# EAGLE design Grove Shield (EAGLE 9.6.2)
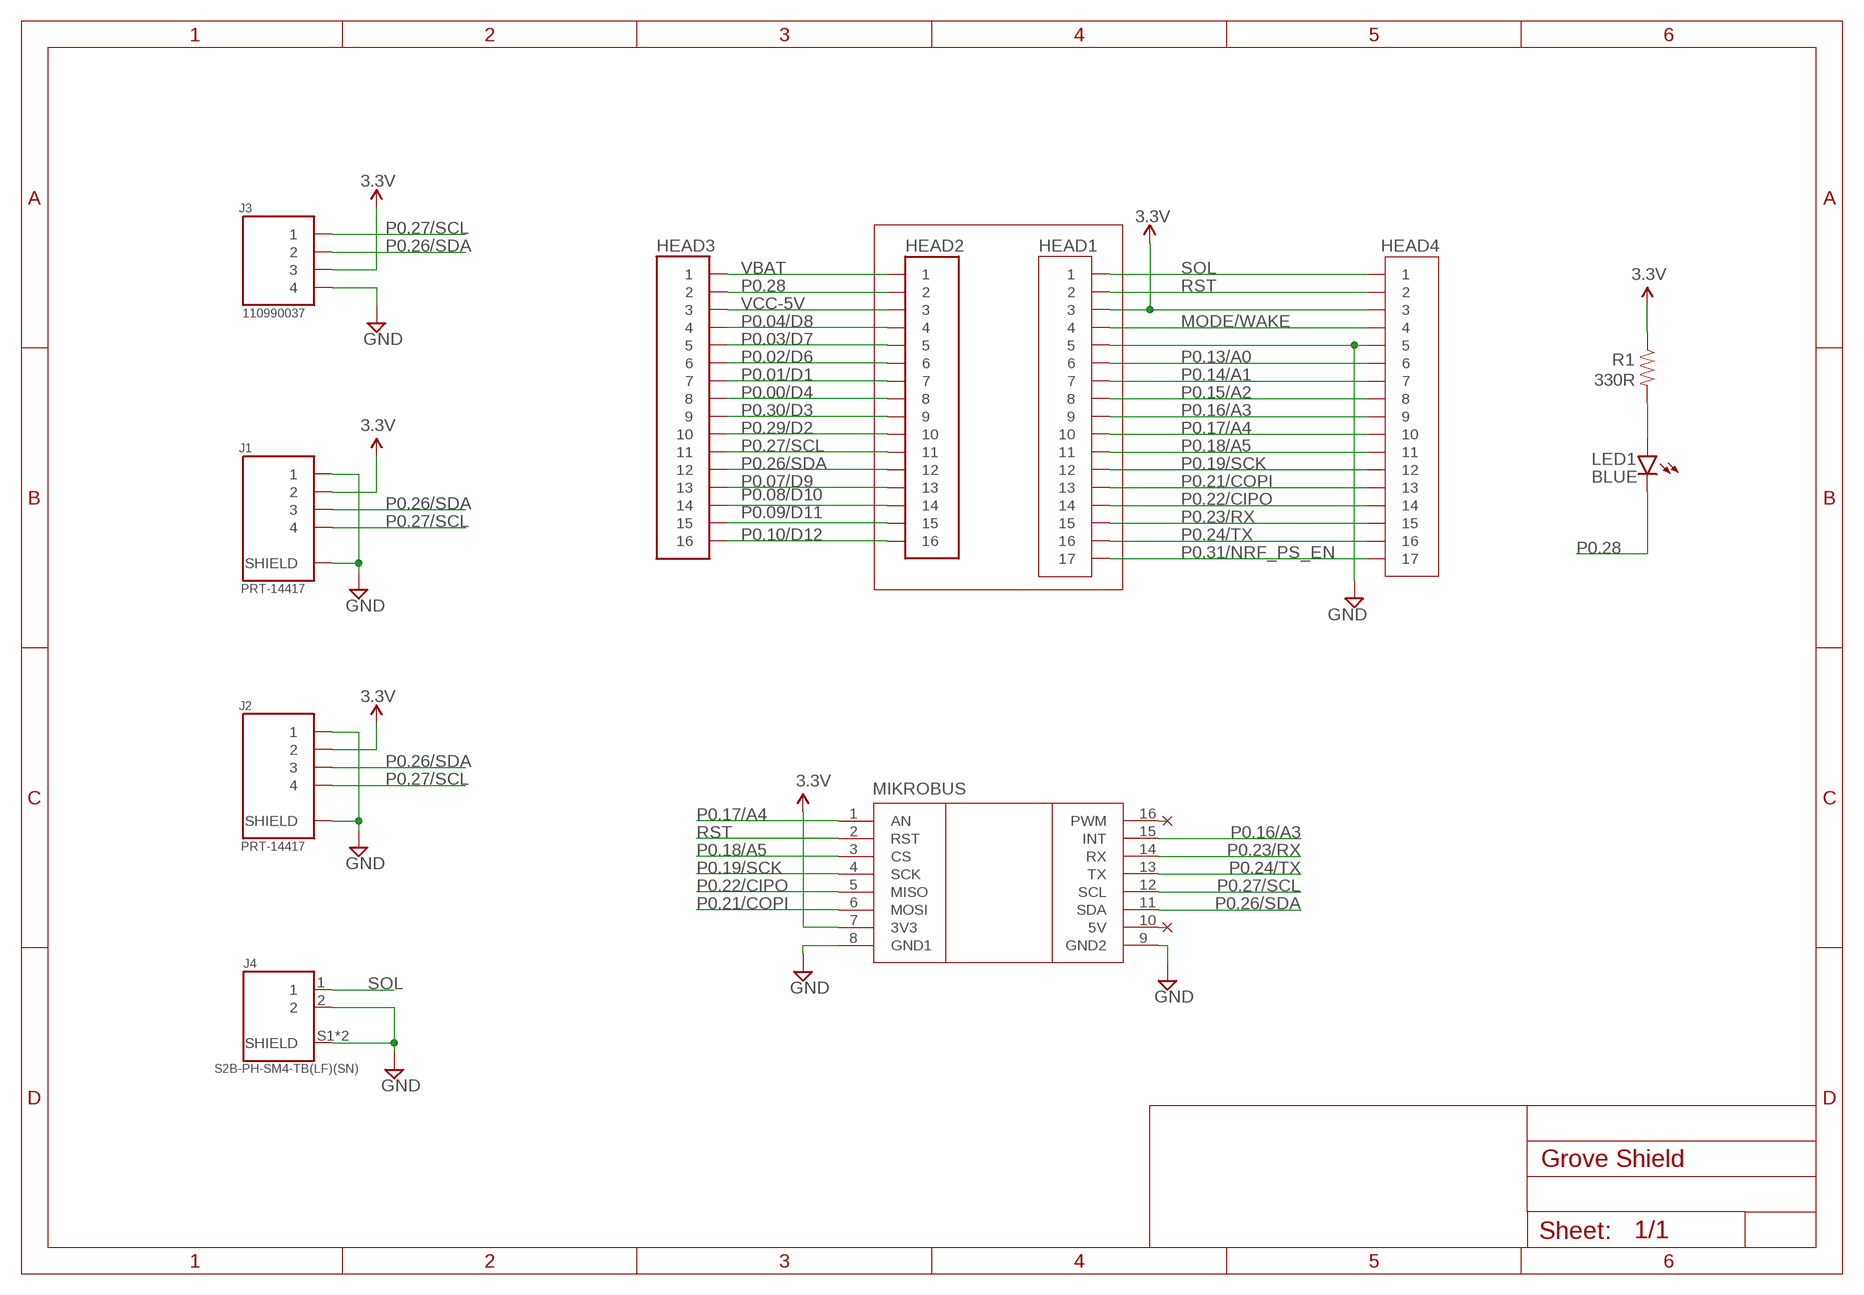
[diagram p0: schematic, sheet 1]

## Parts
HEAD1  HEADER_16P  [HEADER_16P2.54]
HEAD2  SIP-12  [SIP-12]
HEAD3  SIP-12  [SIP-12]
HEAD4  HEADER_16P  [HEADER_16P2.54]
J1  PRT-14417  SM04B-SRSS-TB(LF)(SN)  [JST_SM04B-SRSS-TB(LF)(SN)]
J2  PRT-14417  SM04B-SRSS-TB(LF)(SN)  [JST_SM04B-SRSS-TB(LF)(SN)]
J3  110990037  11099003790D  [HW4-2.0-90D]
J4  S2B-PH-SM4-TB(LF)(SN)  [JST_S2B-PH-SM4-TB(LF)(SN)]
J11  MIKROBUS  [MIKROBUS]
LED1  BLUE  LOL29K-H2L1-24-Z  [LED-0603]
R1  330R  R-0603  [R-0603]

## Nets
3.3V: HEAD1.3 HEAD4.3 J1.2 J2.2 J3.3 J11.7(3V3) R1.1
GND: HEAD1.5 HEAD4.5 J1.1 J1.S1(SHIELD) J1.S2(SHIELD) J2.1 J2.S1(SHIELD) J2.S2(SHIELD) J3.4 J4.2 J4.S1(SHIELD) J4.S2(SHIELD) J11.8(GND1) J11.9(GND2)
MODE/WAKE: HEAD1.4 HEAD4.4
N$1: J11.10(5V)
N$2: J11.16(PWM)
N$3: LED1.A R1.2
P0.00/D4: HEAD2.8 HEAD3.8
P0.01/D1: HEAD2.7 HEAD3.7
P0.02/D6: HEAD2.6 HEAD3.6
P0.03/D7: HEAD2.5 HEAD3.5
P0.04/D8: HEAD2.4 HEAD3.4
P0.07/D9: HEAD2.13 HEAD3.13
P0.08/D10: HEAD2.14 HEAD3.14
P0.09/D11: HEAD2.15 HEAD3.15
P0.10/D12: HEAD2.16 HEAD3.16
P0.13/A0: HEAD1.6 HEAD4.6
P0.14/A1: HEAD1.7 HEAD4.7
P0.15/A2: HEAD1.8 HEAD4.8
P0.16/A3: HEAD1.9 HEAD4.9 J11.15(INT)
P0.17/A4: HEAD1.10 HEAD4.10 J11.1(AN)
P0.18/A5: HEAD1.11 HEAD4.11 J11.3(CS)
P0.19/SCK: HEAD1.12 HEAD4.12 J11.4(SCK)
P0.21/COPI: HEAD1.13 HEAD4.13 J11.6(MOSI)
P0.22/CIPO: HEAD1.14 HEAD4.14 J11.5(MISO)
P0.23/RX: HEAD1.15 HEAD4.15 J11.14(RX)
P0.24/TX: HEAD1.16 HEAD4.16 J11.13(TX)
P0.26/SDA: HEAD2.12 HEAD3.12 J1.3 J2.3 J3.2 J11.11(SDA)
P0.27/SCL: HEAD2.11 HEAD3.11 J1.4 J2.4 J3.1 J11.12(SCL)
P0.28: HEAD2.2 HEAD3.2 LED1.K(C)
P0.29/D2: HEAD2.10 HEAD3.10
P0.30/D3: HEAD2.9 HEAD3.9
P0.31/NRF_PS_EN: HEAD1.17 HEAD4.17
RST: HEAD1.2 HEAD4.2 J11.2(RST)
SOL: HEAD1.1 HEAD4.1 J4.1
VBAT: HEAD2.1 HEAD3.1
VCC-5V: HEAD2.3 HEAD3.3

## Library data of the parts
HEAD1 HEAD4 = Grove Shield:HEADER_16P
HEAD2 HEAD3 = Grove Shield:SIP-12
J1 J2 = Grove Shield:SM04B-SRSS-TB(LF)(SN): SH Series 1.0 mm Pitch 2 Position Single Row Side Entry Shrouded Header Check prices <https://pricing.snapeda.com/parts/SM04B-SRSS-TB%28LF%29%28SN%29/JST%20Sales/view-part?ref=eda>; AVAILABILITY: In Stock; DESCRIPTION: Connector Header Surface Mount, Right Angle 4 position 0.039 (1.00mm); MF: JST Sales; MP: SM04B-SRSS-TB(LF)(SN); PACKAGE: None; PRICE: None; PURCHASE-URL: https://pricing.snapeda.com/search/part/SM04B-SRSS-TB(LF)(SN)/?ref=eda
J3 = Grove Shield:110990037: 4P-2.0:320110033;4P-2.0-90D:320110034
J4 = Grove Shield:S2B-PH-SM4-TB(LF)(SN): PH Series 2 Position 2 mm Pitch Surface Mount Side Entry Shrouded Header; DESCRIPTION: Connector Header Surface Mount, Right Angle 2 position 0.079 (2.00mm); DIGI-KEY_PART_NUMBER: 455-1749-1-ND; MF: JST Sales; MP: S2B-PH-SM4-TB(LF)(SN); PACKAGE: None; PURCHASE-URL: https://pricing.snapeda.com/search/part/S2B-PH-SM4-TB(LF)(SN)/?ref=eda
J11 = My Library:MIKROBUS
LED1 = Morena27_Library:LOL29K-H2L1-24-Z: LED ORANGE DIFF. Vf: 2.2V/20mA/14 mcd/160° (0603); MANUFACTURER: Osram; MANUFACTURER_PART_NUMBER: LO L29K-H2L1-24-Z; PART_TYPE: LED
R1 = My Library:R-0603

## Board
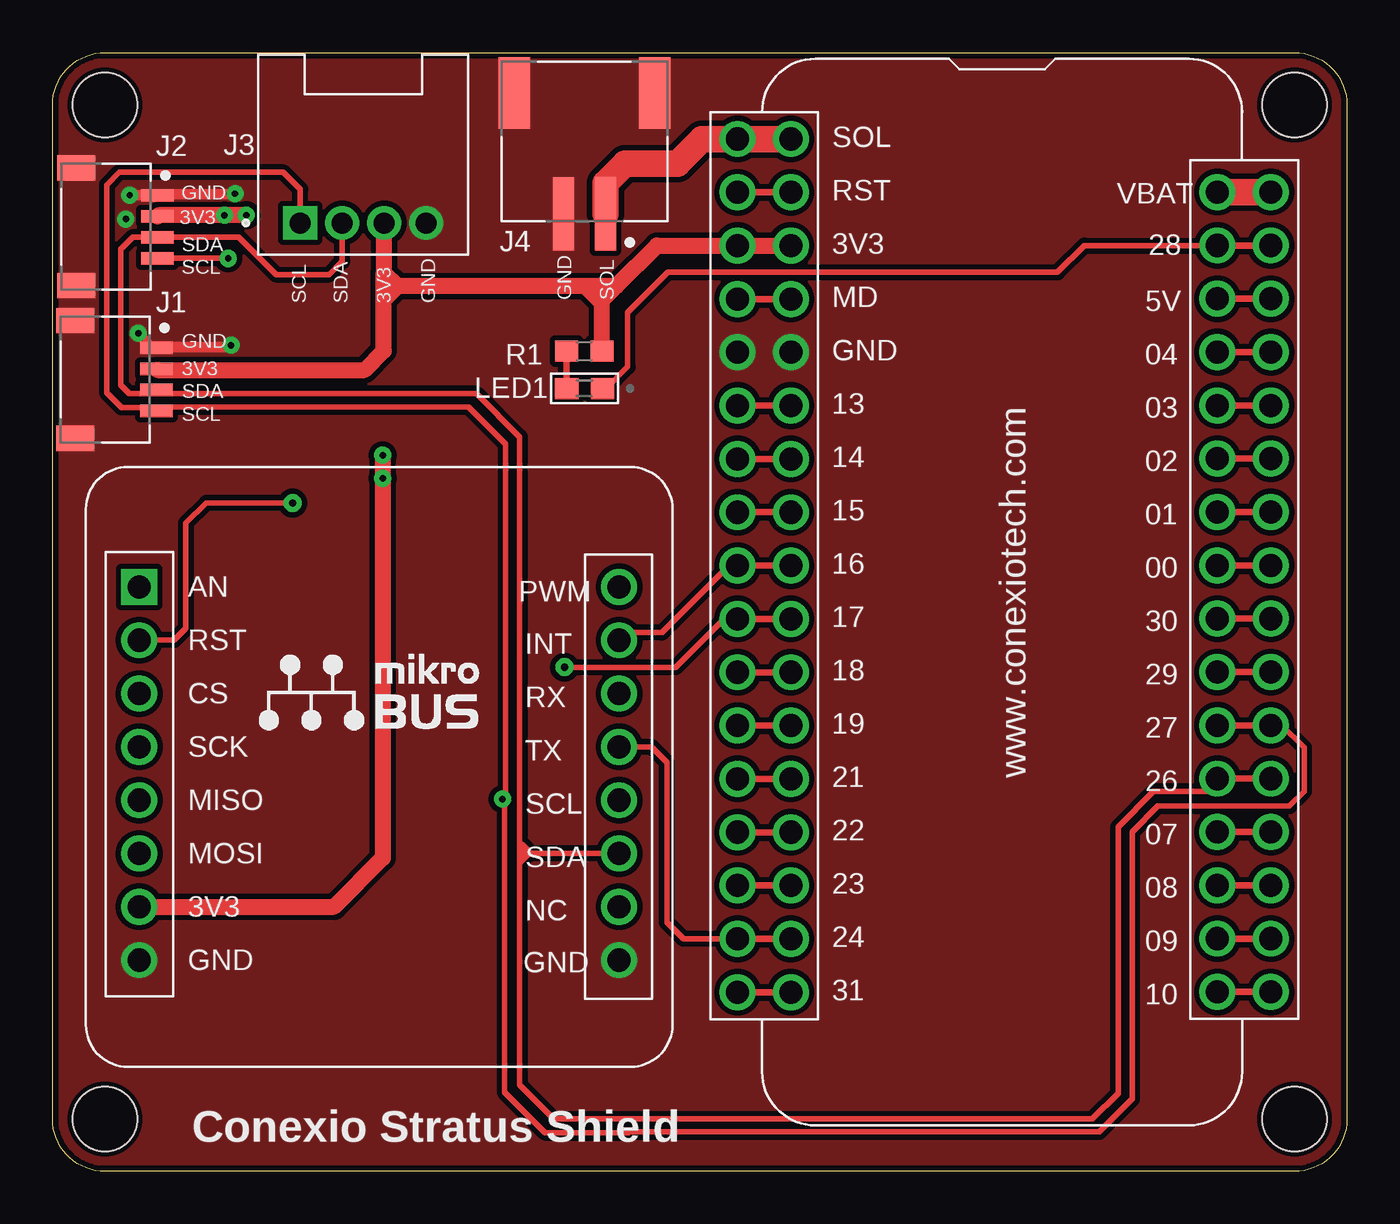
[diagram p1: board, top side]
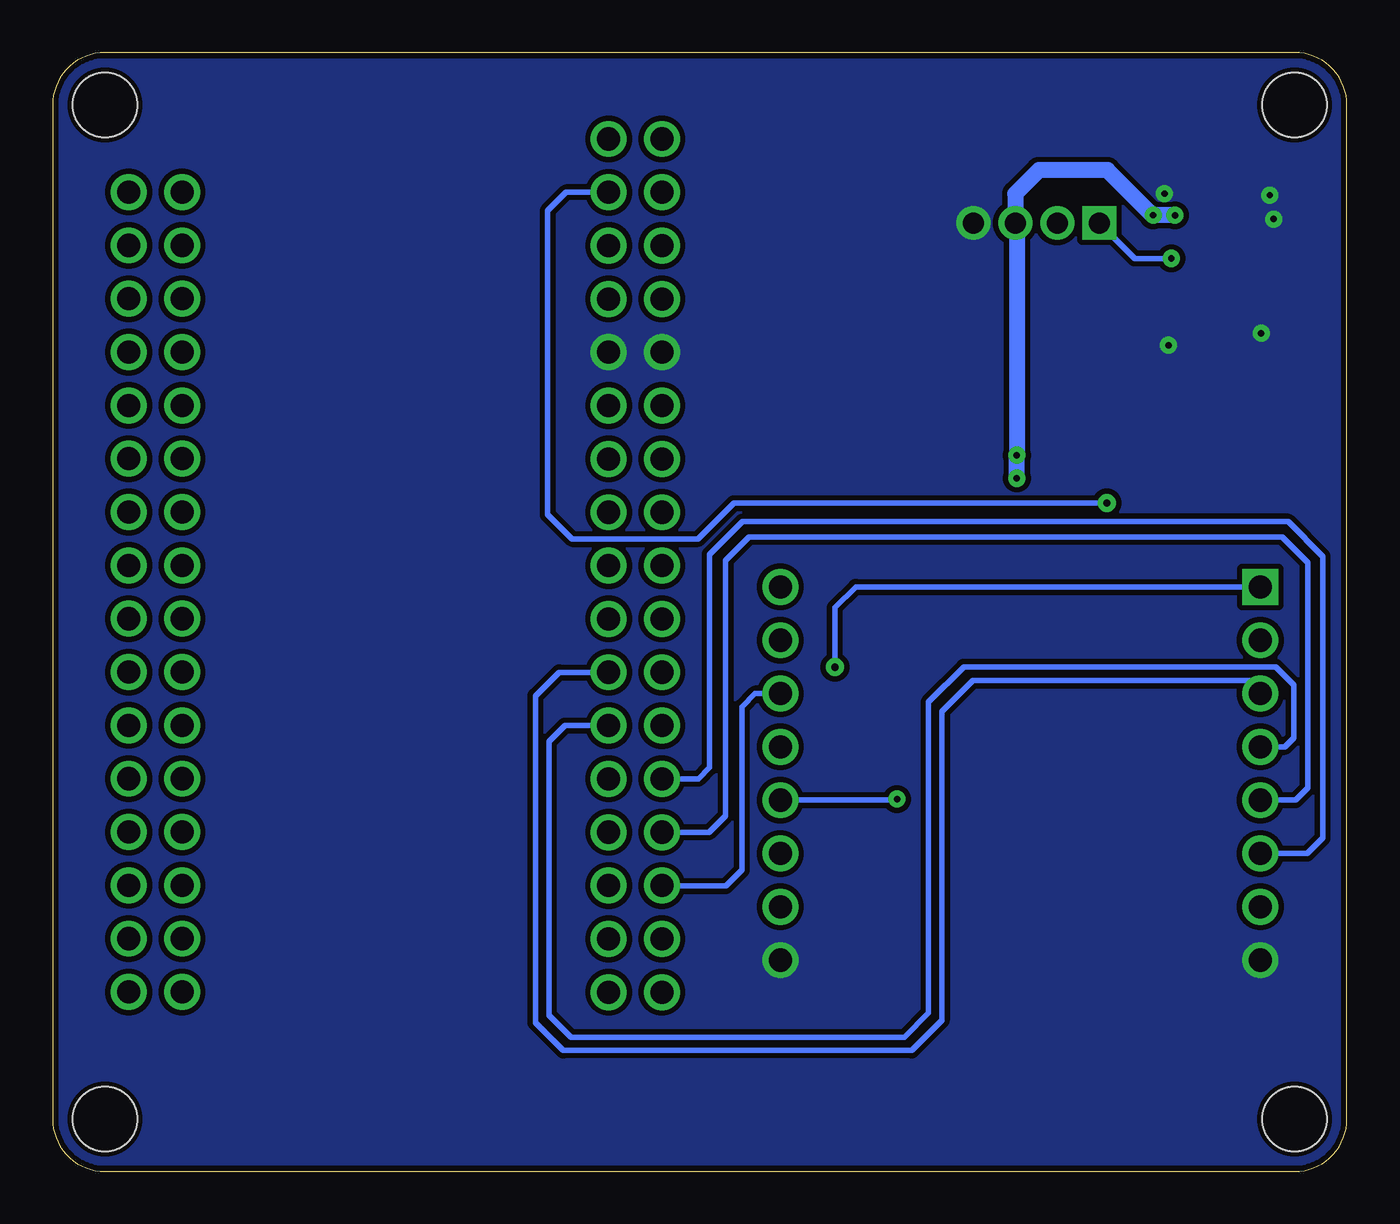
[diagram p2: board, bottom side, seen from below]

Size 61.66 x 53.3 mm. Coordinates in mm from the lower left corner, seen from the top.
Outline: 0,2.5 0,50.8 arc-90 2.5,53.3 59.16,53.3 arc-90 61.66,50.8 61.66,2.5 arc-90 59.16,0 2.5,0 arc-90 0,2.5
Copper layers (1*16): Top 0.035mm / dielectric 1.5mm / Bottom 0.035mm
Design rules "SparkFun-2-layer *": minimum track width 7mil, minimum drill 12mil, track to track 6mil, track to pad 6mil, pad to pad 6mil, via to via 6mil, smd to smd 0mil, copper to edge 6mil, drill to drill 6mil, minimum pad ring 12mil, minimum via ring 10mil, stop-mask expansion 4mil, vias tented up to drill 20mil, thermal gap 10mil
Holes 3.05 mm at 2.5,50.8 59.16,50.8 59.16,2.5 2.5,2.5

### Footprints (pad centres in the part's own frame; a part is rotated, then mirrored left to right if it is on the bottom)
HEADER_16P2.54 = drill 1.1: 1 0,-20.32; 2 0,-17.78; 3 0,-15.24; 4 0,-12.7; 5 0,-10.16; 6 0,-7.62; 7 0,-5.08; 8 0,-2.54; 9 0,0; 10 0,2.54; 11 0,5.08; 12 0,7.62; 13 0,10.16; 14 0,12.7; 15 0,15.24; 16 0,17.78; 17 0,20.32
SIP-12 = drill 1.1: 1 0,19.05; 2 0,16.51; 3 0,13.97; 4 0,11.43; 5 0,8.89; 6 0,6.35; 7 0,3.81; 8 0,1.27; 9 0,-1.27; 10 0,-3.81; 11 0,-6.35; 12 0,-8.89; 13 0,-11.43; 14 0,-13.97; 15 0,-16.51; 16 0,-19.05
JST_SM04B-SRSS-TB(LF)(SN) = smd 0.6 x 1.55: 1 -1.5,0; 2 -0.5,0; 3 0.5,0; 4 1.5,0 | smd 1.2 x 1.8: S1 -2.8,-3.875; S2 2.8,-3.875
HW4-2.0-90D = drill 1 square: 1 -3,0 | drill 1: 2 -1,0; 3 1,0; 4 3,0
JST_S2B-PH-SM4-TB(LF)(SN) = smd 1 x 3.5: 1 -1,0; 2 1,0 | smd 1.5 x 3.4: S1 -3.35,-5.75; S2 3.35,-5.75
MIKROBUS = drill 1.1 square: 1 -11.43,8.89 | drill 1.1: 2 -11.43,6.35; 3 -11.43,3.81; 4 -11.43,1.27; 5 -11.43,-1.27; 6 -11.43,-3.81; 7 -11.43,-6.35; 8 -11.43,-8.89; 9 11.43,-8.89; 10 11.43,-6.35; 11 11.43,-3.81; 12 11.43,-1.27; 13 11.43,1.27; 14 11.43,3.81; 15 11.43,6.35; 16 11.43,8.89
LED-0603 = smd 1.1 x 1: A -0.85,0; K 0.85,0
R-0603 = smd 1.1 x 1: 1 -0.85,0; 2 0.85,0

### Placement (x,y rotation side)
HEAD1  35.17,28.86 180 top
HEAD2  55.49,27.6 0 top
HEAD3  58.03,27.6 0 top
HEAD4  32.63,28.86 180 top
J1  4.96,37.73 270 top
J2  5,45 270 top
J3  14.8,45.18 0 top
J4  25.34,45.61 180 top
J11  15.56,18.96 0 top
LED1  25.35,37.3 0 top
R1  25.33,39.07 180 top

### Tracks (layer width: path | path; a pad name or v marks a point on that pad's centre or on a via)
3.3V  (via drill 0.3)
  Top 0.254: J1.2 5,38.18
  Top 0.762: 15.8,42.79 J3.3 | 26.84,42.16 28.78,44.1 HEAD4.3 HEAD1.3 | 26.84,42.16 26.5,42.16 | 26.5,42.16 25.38,42.16 | 25.38,42.16 16.43,42.16 | 16.43,42.16 15.8,42.79 | 15.8,42.79 15.77,42.82 15.77,41.5 | R1.1 26.18,41.5 | 26.18,41.5 26.18,41.84 26.5,42.16 | 26.18,41.5 26.84,42.16 | 26.18,41.5 26.04,41.5 25.38,42.16 | v9.23,45.55 5.05,45.55 J2.2 | 5,38.18 14.86,38.18 15.77,39.1 15.77,41.5 | 16.43,42.16 15.77,41.5 | J11.7 13.41,12.61 15.73,14.93 v15.73,34.11
  Bottom 0.508: v8.2,45.54 8.17,45.54 8.16,45.55 | v15.73,33.02 15.73,32.98
  Bottom 0.762: 8.16,45.55 v9.23,45.55 9.26,45.55 11.41,47.7 14.67,47.7 15.8,46.57 J3.3 15.72,45.11 v15.72,34.12 v15.73,34.11 15.73,32.98
GND  (via drill 0.3)
  Top 0.508: v8.69,46.58 8.67,46.55 5.05,46.55 J2.1 v3.69,46.5 v3.68,46.51 | v8.51,39.36 8.42,39.27 5,39.27 J1.1 4.75,39.23 4.09,39.89 v4.09,39.93
  other vias: 3.49,45.36
  pour Bottom (isolate 0.254, no thermals): 22,54.5 63,54.5 63,39 63,-1.5 53,-1.5 -1.5,-1.5 -1.5,12 -1.5,54.5
  pour Top (isolate 0.254, no thermals): -1.5,54.5 63,54.5 63,-1.5 -1.5,-1.5
MODE/WAKE
  Top 0.305: HEAD4.4 HEAD1.4
N$3
  Top 0.305: LED1.A 24.48,37.31 R1.2
P0.00/D4
  Top 0.305: HEAD2.8 HEAD3.8
P0.01/D1
  Top 0.305: HEAD2.7 HEAD3.7
P0.02/D6
  Top 0.305: HEAD2.6 HEAD3.6
P0.03/D7
  Top 0.305: HEAD2.5 HEAD3.5
P0.04/D8
  Top 0.305: HEAD2.4 HEAD3.4
P0.07/D9
  Top 0.305: HEAD2.13 HEAD3.13
P0.08/D10
  Top 0.305: HEAD2.14 HEAD3.14
P0.09/D11
  Top 0.305: HEAD2.15 HEAD3.15
P0.10/D12
  Top 0.305: HEAD2.16 HEAD3.16
P0.13/A0
  Top 0.305: HEAD4.6 HEAD1.6
P0.14/A1
  Top 0.305: HEAD4.7 HEAD1.7
P0.15/A2
  Top 0.305: HEAD4.8 HEAD1.8
P0.16/A3
  Top 0.254: J11.15 26.99,25.67 29.03,25.67 32.22,28.86 HEAD4.9
  Top 0.305: HEAD4.9 HEAD1.9
P0.17/A4  (via drill 0.35)
  Top 0.254: HEAD4.10 31.98,26.32 29.67,24.01 v24.4,24.01 v24.39,24.02
  Top 0.305: HEAD4.10 HEAD1.10
  Bottom 0.254: J11.1 23.4,27.85 24.39,26.86 v24.39,24.02
P0.18/A5
  Top 0.305: HEAD4.11 HEAD1.11
  Bottom 0.254: J11.3 4.13,23.39 17.82,23.39 19.3,21.91 19.3,7.19 20.73,5.77 37.34,5.77 38.65,7.09 38.65,22.65 37.52,23.78 HEAD1.11
P0.19/SCK
  Top 0.305: HEAD4.12 HEAD1.12
  Bottom 0.254: J11.4 2.96,20.23 2.53,20.66 2.53,23.17 3.4,24.04 18.25,24.04 19.93,22.36 19.93,7.55 21.09,6.39 36.96,6.39 38,7.43 38,20.49 37.25,21.24 HEAD1.12
P0.21/COPI
  Top 0.305: HEAD4.13 HEAD1.13
  Bottom 0.254: J11.6 1.9,15.15 1.16,15.89 1.16,29.3 2.8,30.95 28.8,30.95 30.36,29.4 30.36,19.23 30.89,18.7 HEAD4.13
P0.22/CIPO
  Top 0.305: HEAD4.14 HEAD1.14
  Bottom 0.254: J11.5 2.44,17.69 1.87,18.26 1.87,29 3.08,30.22 28.49,30.22 29.61,29.1 29.61,16.95 30.39,16.16 HEAD4.14
P0.23/RX
  Top 0.305: HEAD4.15 HEAD1.15
  Bottom 0.254: HEAD4.15 32.61,13.6 29.59,13.6 28.82,14.36 28.82,22.13 28.19,22.77 J11.14
P0.24/TX
  Top 0.254: HEAD4.16 30.05,11.08 29.27,11.87 29.27,19.48 28.52,20.23 J11.13
  Top 0.305: HEAD4.16 HEAD1.16
P0.26/SDA
  Top 0.254: J3.2 13.8,43.35 13.18,42.73 10.64,42.73 8.87,44.5 J2.3 3.82,44.5 3.24,43.92 3.24,37.47 3.65,37.05 4.78,37.05 J1.3 5.13,37.05 20.19,37.05 22.25,34.99 22.25,15.7 | 22.25,15.7 22.25,15.02 | 22.25,15.02 22.25,14.7 | 22.25,14.7 22.25,4.13 23.88,2.5 49.54,2.5 50.76,3.73 50.76,16.41 52.44,18.09 55.49,18.09 HEAD2.12 | J11.11 22.8,15.15 | 22.8,15.15 22.69,15.15 22.25,14.7 | 22.8,15.15 22.47,15.47 | 22.47,15.47 22.25,15.7 | 22.47,15.47 22.47,15.25 22.25,15.02
  Top 0.305: HEAD2.12 HEAD3.12
P0.27/SCL  (via drill 0.3)
  Top 0.254: J3.1 11.8,46.78 10.99,47.59 3.19,47.59 2.58,46.99 2.58,37.1 3.29,36.4 4.79,36.4 J1.4 5.13,36.4 19.82,36.4 21.57,34.66 21.57,17.87 v21.43,17.74 21.54,17.63 21.54,3.78 23.47,1.85 27.43,1.85 27.46,1.88 49.85,1.88 51.42,3.45 51.42,16.18 52.66,17.41 58.91,17.41 59.61,18.11 59.61,20.19 58.55,21.25 HEAD3.11 | J2.4 v8.36,43.5 v8.37,43.49
  Top 0.305: HEAD2.11 HEAD3.11
  Bottom 0.254: v8.37,43.49 10.11,43.49 J3.1 | J11.12 21.49,17.69 v21.43,17.74
P0.28
  Top 0.254: LED1.K 26.37,37.3 27.4,38.33 27.4,40.91 29.32,42.83 47.87,42.83 49.15,44.11 HEAD2.2
  Top 0.305: HEAD2.2 HEAD3.2
P0.29/D2
  Top 0.305: HEAD2.10 HEAD3.10
P0.30/D3
  Top 0.305: HEAD2.9 HEAD3.9
P0.31/NRF_PS_EN
  Top 0.305: HEAD4.17 HEAD1.17
RST  (via drill 0.35)
  Top 0.254: v11.44,31.84 7.32,31.84 6.36,30.88 6.36,25.87 5.79,25.31 J11.2
  Top 0.305: HEAD4.2 HEAD1.2
  Bottom 0.254: HEAD1.2 37.19,46.64 38.07,45.76 38.07,31.29 36.91,30.13 30.91,30.13 29.21,31.83 v11.45,31.83 v11.44,31.84
SOL
  Top 1.27: J4.1 26.34,47.07 27.28,48.01 29.77,48.01 30.93,49.18 HEAD4.1 HEAD1.1
VBAT
  Top 1.27: HEAD2.1 HEAD3.1
VCC-5V
  Top 0.305: HEAD2.3 HEAD3.3

### Text on the board
tPlace: SOL | GND | RST | VBAT | 3V3 | SDA | 3V3 | 28 | SCL | GND | SOL | SCL | SDA | 3V3 | GND | MD | 5V | GND | GND | 3V3 | 04 | SDA | SCL | 13 | 03 | 14 | 02 | 15 | 01 | 16 | 00 | AN | PWM | 17 | 30 | RST | INT | 18 | 29 | CS | RX | 19 | 27 | SCK | TX | www.conexiotech.com | 21 | 26 | MISO | SCL | 22 | 07 | MOSI | SDA | 23 | 08 | 3V3 | NC | 24 | 09 | GND | GND | 31 | 10 | Conexio Stratus Shield